# EAGLE design SpeccyPower5v (EAGLE 6.3)
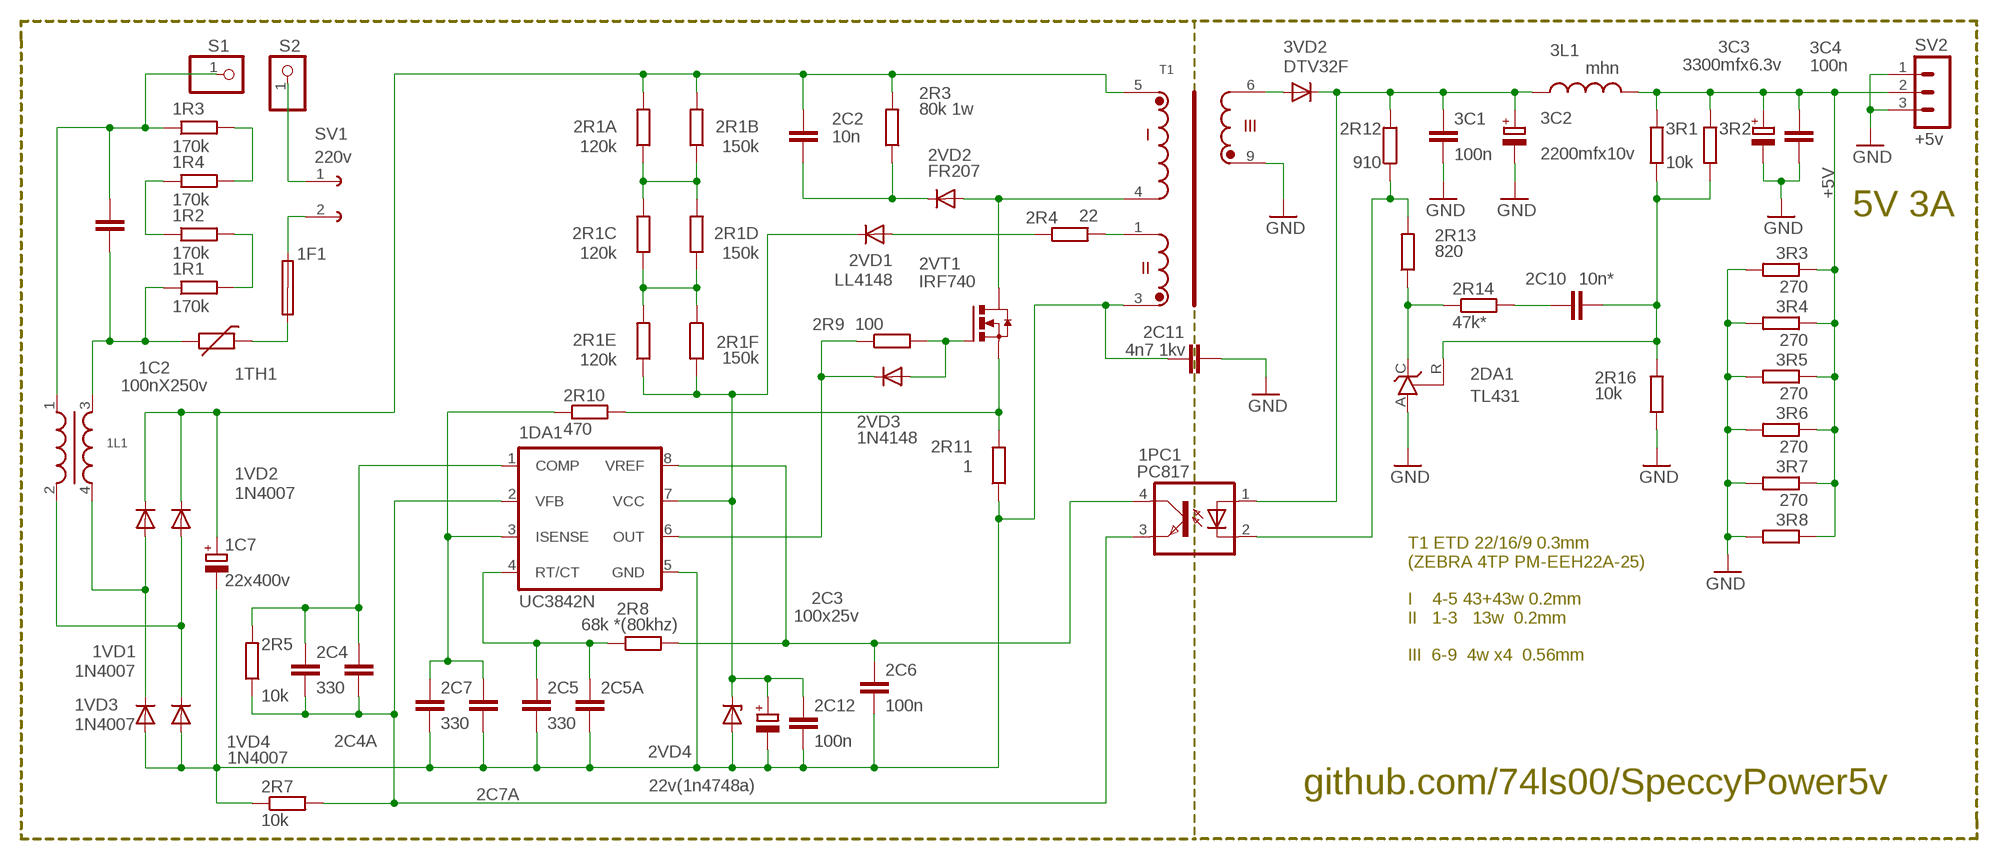
[diagram p0: schematic, sheet 1]

## Parts
1C2  100nX250v  C-EU150-064X183  [C150-064X183]
1C7  22x400v  CPOL-EUTT5D11L  [TT5D11L]
1DA1  UC3842N  [DIL08]
1F1  SHK20L  [SHK20L]
1L1  LFLF-10X13  [LF-10X13]
1PC1  PC817  [DIL04]
1R1  170k  R-EU_R0805  [R0805]
1R2  170k  R-EU_R0805  [R0805]
1R3  170k  R-EU_R0805  [R0805]
1R4  170k  R-EU_R0805  [R0805]
1TH1  THERMISTOR-7,5  [R-7,5]
1VD1  1N4007  1N4004  [DO41-10]
1VD2  1N4007  1N4004  [DO41-10]
1VD3  1N4007  1N4004  [DO41-10]
1VD4  1N4007  1N4004  [DO41-10]
2C2  10n  C-EU102-043X133  [C102-043X133]
2C3  100x25v  CPOL-EUE2.5-6  [E2,5-6]
2C4  330  C-EU050-025X075  [C050-025X075]
2C4A  C-EUC0805  [C0805]
2C5  330  C-EU050-025X075  [C050-025X075]
2C5A  C-EUC0805  [C0805]
2C6  100n  C-EUC0805  [C0805]
2C7  330  C-EU050-025X075  [C050-025X075]
2C7A  C-EUC0805  [C0805]
2C10  10n*  C-EU050-025X075  [C050-025X075]
2C11  4n7 1kv  C-EU075-032X103  [C075-032X103]
2C12  100n  C-EUC0805  [C0805]
2DA1  TL431  TL431CLP  [TO92-CLP]
2R1A  120k  R-EU_M0805  [M0805]
2R1B  150k  R-EU_M0805  [M0805]
2R1C  120k  R-EU_M0805  [M0805]
2R1D  150k  R-EU_M0805  [M0805]
2R1E  120k  R-EU_M0805  [M0805]
2R1F  150k  R-EU_M0805  [M0805]
2R3  80k 1w  R-EU_0613/15  [P0613/15]
2R4  22  R-EU_M0805  [M0805]
2R5  10k  R-EU_0207/10  [0207/10]
2R7  10k  R-EU_0207/10  [0207/10]
2R8  68k *(80khz)  R-EU_R0805  [R0805]
2R9  100  R-EU_0204/7  [0204/7]
2R10  470  R-EU_0207/10  [0207/10]
2R11  1  R-EU_0411/15  [0411/15]
2R12  910  R-EU_R0805  [R0805]
2R13  820  R-EU_0204/7  [0204/7]
2R14  47k*  R-EU_R0805  [R0805]
2R16  10k  R-EU_R0805  [R0805]
2VD1  LL4148  DIODE-SOD80C  [SOD80C]
2VD2  FR207  1N4148DO35-10  [DO35-10]
2VD3  1N4148  1N4148DO35-7  [DO35-7]
2VD4  22v(1n4748a)  ZENER-DIODEDO35Z10  [DO35Z10]
2VT1  IRF740  IRF3704L-V  [TO262-V]
3C1  100n  C-EUC0805  [C0805]
3C2  2200mfx10v  CPOL-EUTT2D7L  [TT2D7L]
3C3  3300mfx6.3v  CPOL-EUTT2D7L-2  [TT2D7L-2]
3C4  100n  C-EUC0805  [C0805]
3L1  mhn  L-USLAL02  [LAL02]
3R1  10k  R-EU_R0805  [R0805]
3R2  R-EU_R0805  [R0805]
3R3  270  R-EU_R0805  [R0805]
3R4  270  R-EU_R0805  [R0805]
3R5  270  R-EU_R0805  [R0805]
3R6  270  R-EU_R0805  [R0805]
3R7  270  R-EU_R0805  [R0805]
3R8  R-EU_R0805  [R0805]
3VD2  DTV32F  DIODE-DO220S  [DO220S]
S1  PINHD-1X1  [1X01]
S2  PINHD-1X1  [1X01]
SV1  220v  IEC320-C8  [IEC320-C8]
SV2  +5v  MA03-1  [MA03-1]
T1  TRANS_ER29  [ER29]

## Nets
817-3: 1DA1.2(VFB) 1PC1.3(EMIT) 2C4.2 2C4A.2 2R5.1 2R7.2
+5V: 3C3.+ 3C4.1 3L1.2 3R1.2 3R2.2 3R3.1 3R4.1 3R5.1 3R6.1 3R7.1 3R8.1 SV2.2
+16IN: 1DA1.7(VCC) 2C3.+ 2C12.1 2R1E.1 2R1F.2 2VD1.C 2VD4.C
+IN: 1C7.+ 1VD1.C 1VD2.C 2C2.1 2R1A.2 2R1B.2 2R3.2 T1.5(IN2)
-IN: 1C7.- 1DA1.5(GND) 1VD3.A 1VD4.A 2C3.- 2C5.2 2C5A.2 2C6.2 2C7.2 2C7A.2 2C11.1 2C12.2 2R7.1 2R11.1 2VD4.A T1.3(OP2)
COMP: 1DA1.1(COMP) 2C4.1 2C4A.1 2R5.2
GND: 2C11.2 2DA1.A 2R16.1 3C1.2 3C2.- 3C3.- 3C4.2 3R3.2 3R4.2 3R5.2 3R6.2 3R7.2 3R8.2 SV2.1 SV2.3 T1.9(5V2)
N$1: 1L1.4 1VD1.A 1VD3.C
N$2: 1C2.1 1L1.3 1R1.1 1TH1.2
N$3: 1DA1.4(RT/CT) 2C5.1 2C5A.1 2R8.1
N$4: 1DA1.3(ISENSE) 2C7.1 2C7A.1 2R10.1
N$6: 2R4.1 2VD1.A
N$8: 1DA1.6(OUT) 2R9.1 2VD3.C
N$11: 2R9.2 2VD3.A 2VT1.1(G)
N$12: 1PC1.2(C) 2R12.1 2R13.2
N$13: 1PC1.1(A) 2R12.2 3C1.1 3C2.+ 3L1.1 3VD2.C
N$14: 2DA1.C 2R13.1 2R14.1
N$15: 1F1.1A SV1.2
N$16: 2C10.2 2R14.2
N$17: 2VD2.A 2VT1.2(D) T1.4(IN1)
N$18: 1R3.2 1R4.2
N$19: 2R1C.1 2R1D.1 2R1E.2 2R1F.1
N$20: 1DA1.8(VREF) 1PC1.4(COL) 2C6.1 2R8.2
N$21: 2R10.2 2R11.2 2VT1.3(S)
N$22: 2R4.2 T1.1(OP1)
N$25: 1R2.1 1R4.1
N$26: 2C10.1 2DA1.R 2R16.2 3R1.1 3R2.1
N$28: 3VD2.A T1.6(5V1)
N$29: 2R1A.1 2R1B.1 2R1C.2 2R1D.2
N$30: 2C2.2 2R3.1 2VD2.C
N$32: 1C2.2 1L1.1 1R3.1 S1.1
N$36: S2.1 SV1.1
N$44: 1L1.2 1VD2.A 1VD4.C
N$45: 1F1.2A 1TH1.1
N$46: 1R1.2 1R2.2
Unconnected: 1F1.1B 1F1.2B

## Notes on the sheet
- 5V 3A
- T1 ETD 22/16/9 0.3mm
  (ZEBRA 4TP PM-EEH22A-25)
  
  I    4-5 43+43w 0.2mm
  II   1-3   13w  0.2mm
  
  III  6-9  4w x4  0.56mm
- github.com/74ls00/SpeccyPower5v

## Library data of the parts
1C2 = SpeccyPower5v:C-EU: CAPACITOR, European symbol
1C7 3C2 3C3 = SpeccyPower5v:CPOL-EU: POLARIZED CAPACITOR, European symbol
1DA1 = SpeccyPower5v:UC384*: SMPS Controller Source: http://www.fairchildsemi.com/ds/UC/UC3843.pdf
1F1 = fuse:SHK20L: FUSE HOLDER 5 x 20 mm, SH contact, SHH1 Schukat, E1073 Buerklin; OC_FARNELL: unknown; OC_NEWARK: unknown
1L1 = SpeccyPower5v:LF
1PC1 = optocoupler:PC817: SHARP OPTO COUPLER; MPN: PC817X4J000F; OC_FARNELL: 9707727; OC_NEWARK: 97K7059
1R1-1R4 2R1A 2R1B 2R1C 2R1D 2R1E 2R1F 2R3-2R5 2R7-2R14 2R16 3R1-3R8 = rcl:R-EU_: RESISTOR, European symbol
1TH1 = varistor:THERMISTOR: THERMISTOR
1VD1-1VD4 = diode:1N4004: DIODE general purpose rectifier, 1 A
2C2 2C4 2C4A 2C5 2C5A 2C6 2C7 2C7A 2C10-2C12 3C1 3C4 = rcl:C-EU: CAPACITOR, European symbol
2C3 = rcl:CPOL-EU: POLARIZED CAPACITOR, European symbol
2DA1 = v-reg:TL431CLP: VOLTAGE REGULATOR
2VD1 3VD2 = diode:DIODE-: DIODE
2VD2 2VD3 = SpeccyPower5v:1N4148: DIODE high speed (Philips)
2VD4 = SpeccyPower5v:ZENER-DIODE: Z-Diode
2VT1 = transistor-power:IRF3704: SMPS MOSFET HEXFET® Power MOSFET Source: http://www.irf.com/product-info/datasheets/data/irf3704.pdf
3L1 = rcl:L-US: INDUCTOR, American symbol
S1 S2 = pinhead:PINHD-1X1: PIN HEADER
SV1 = SpeccyPower5v:IEC320-C8: FEMALE HEADER; OC_FARNELL: unknown; OC_NEWARK: unknown
SV2 = con-lstb:MA03-1: PIN HEADER; OC_FARNELL: unknown; OC_NEWARK: unknown
T1 = SpeccyPower5v:TRANS_ER29

## Board
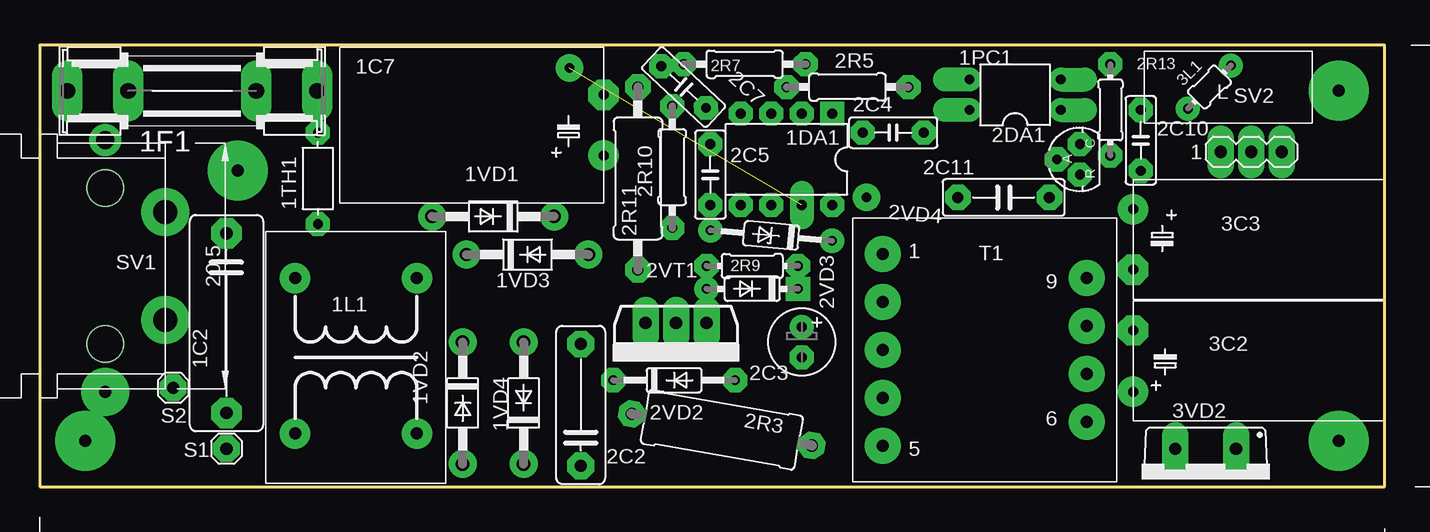
[diagram p1: board, top side]
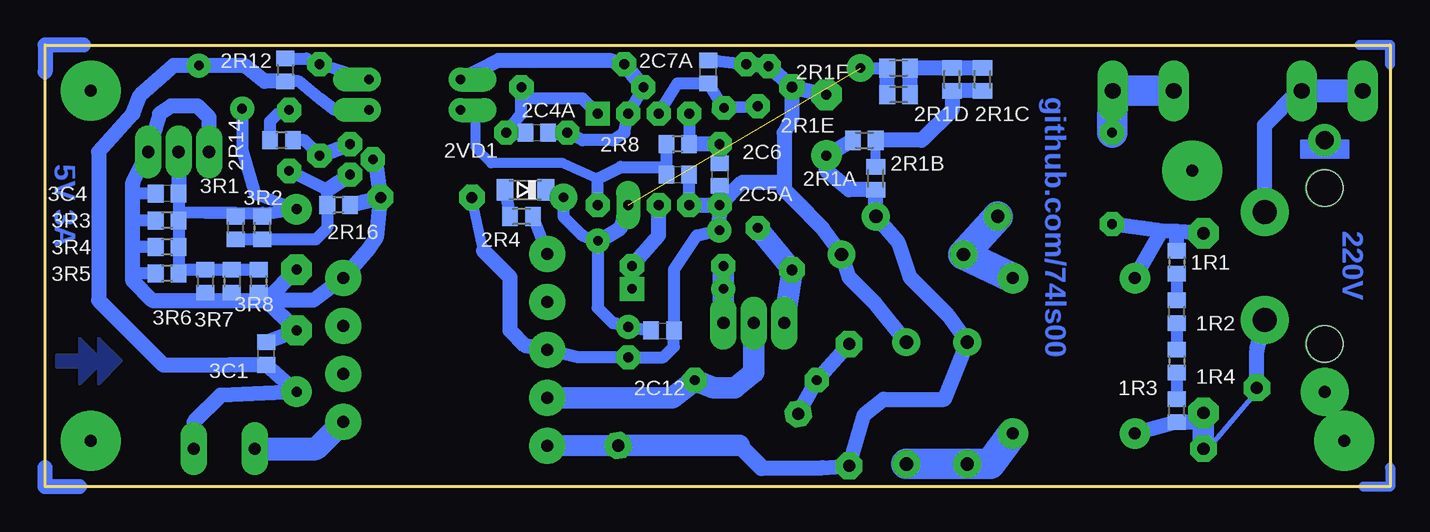
[diagram p2: board, bottom side, seen from below]

Size 112.08 x 36.83 mm. Coordinates in mm from the lower left corner, seen from the top.
Outline: 0,36.83 0,0 112.08,0 112.08,36.83 0,36.83
Copper layers (1*16): Top 0.035mm / dielectric 1.5mm / Bottom 0.035mm
Design rules "DesignRules": minimum track width 8mil, minimum drill 24mil, track to track 0.2mm, track to pad 0.2mm, pad to pad 8mil, via to via 8mil, smd to smd 8mil, copper to edge 10mil, drill to drill 8mil, minimum pad ring 0.6mm, minimum via ring 8mil, stop-mask expansion 4mil, vias tented up to drill 0mil, thermal gap 10mil

### Footprints (pad centres in the part's own frame; a part is rotated, then mirrored left to right if it is on the bottom)
C150-064X183 = drill 1.016 pad 2.54 octagon: 1 -7.493,0; 2 7.493,0
TT5D11L = drill 0.813 pad 2.54: + -2.54,0 | drill 0.813 pad 2.54 octagon: - 2.54,0
DIL08 = drill 0.813 square: 1 -3.81,-3.81 | drill 0.813 octagon: 2 -1.27,-3.81; 3 1.27,-3.81; 4 3.81,-3.81; 5 3.81,3.81; 6 1.27,3.81; 8 -3.81,3.81 | drill 0.813 long: 7 -1.27,3.81
SHK20L = drill 1.321 pad 2.54 long: 1A -10.414,0; 1B -5.334,0; 2A 10.414,0; 2B 5.334,0
LF-10X13 = drill 1 pad 2.54: 1 -6.35,5.08; 2 -6.35,-5.08; 3 6.604,5.08; 4 6.604,-5.08
DIL04 = drill 0.813 offset: 1 -1.27,-3.81; 2 1.27,-3.81; 3 1.27,3.81; 4 -1.27,3.81
R0805 = smd 1.3 x 1.5: 1 -0.95,0; 2 0.95,0
R-7,5 = drill 0.813 octagon: 1 -3.81,0; 2 3.81,0
DO41-10 = drill 1.118: A 5.08,0; C -5.08,0
C102-043X133 = drill 1.016 octagon: 1 -5.08,0; 2 5.08,0
E2,5-6 = drill 0.813 pad 1.6: + -1.27,0 | drill 0.813 pad 1.6 octagon: - 1.27,0
C050-025X075 = drill 0.813 octagon: 1 -2.54,0; 2 2.54,0
C0805 = smd 1.3 x 1.5: 1 -0.95,0; 2 0.95,0
C075-032X103 = drill 0.914 octagon: 1 -3.81,0; 2 3.81,0
TO92-CLP = drill 0.813 octagon: A 0,1.905; C 1.27,0; R -1.27,0
M0805 = smd 1.3 x 1.6: 1 -0.95,0; 2 0.95,0
P0613/15 = drill 1.016 octagon: 1 -7.62,0; 2 7.62,0
0207/10 = drill 0.813 octagon: 1 -5.08,0; 2 5.08,0
0204/7 = drill 0.813 octagon: 1 -3.81,0; 2 3.81,0
0411/15 = drill 0.914 octagon: 1 -7.62,0; 2 7.62,0
SOD80C = smd 1.4 x 1.8: A 1.7,0; C -1.7,0
DO35-10 = drill 0.813 octagon: A 5.08,0; C -5.08,0
DO35-7 = drill 0.813: A 3.81,0 | drill 0.813 square: C -3.81,0
DO35Z10 = drill 0.813: A 5.08,0; C -5.08,0
TO262-V = drill 1.016 long: 1 -2.54,0; 2 0,0; 3 2.54,0
TT2D7L = drill 0.813 pad 2.54: + 2.56,0 | drill 0.813 pad 2.54 octagon: - -2.56,0
TT2D7L-2 = drill 0.813 pad 2.54: + -2.52,0 | drill 0.813 pad 2.54 octagon: - 2.52,0
LAL02 = drill 0.8 pad 1.3: 1 -2.54,0; 2 2.54,0
DO220S = drill 1.016 long: A 2.54,-2.54; C -2.54,-2.54
1X01 = drill 1.016 octagon: 1 0,0
IEC320-C8 = drill 2 pad 4: 1 -4.5,-13; 2 4.5,-13 | drill 2 pad 3: P$3 -6.5,-8; P$4 6.5,-8 | drill 1 pad 4: P$5 -10.5,-8 | drill 1.5 pad 2.54: P$6 10.5,-8 | hole 3: -6.5,-8; 6.5,-8
MA03-1 = drill 1.016 long: 1 -2.54,0; 2 0,0; 3 2.54,0
ER29 = drill 1 pad 3: 1 -8.5,8; 2 -8.5,4; 3 -8.5,0; 4 -8.5,-4; 5 -8.5,-8; 6 8.5,-6; 7 8.5,-2; 8 8.5,2; 9 8.5,6

### Placement (x,y rotation side)
1C2  15.56,13.65 270 top
1C7  46.99,30.16 90 top
1DA1  62.23,27.3 180 top
1F1  12.7,33.02 0 top
1L1  26.35,10.8 90 top
1PC1  81.28,32.7 90 top
1R1  17.78,18.73 270 bottom
1R2  17.78,14.61 90 bottom
1R3  17.78,6.35 90 bottom
1R4  17.78,10.48 270 bottom
1TH1  23.18,25.72 270 top
1VD1  37.78,22.54 180 top
1VD2  35.24,6.98 270 top
1VD3  40.64,19.37 0 top
1VD4  40.32,6.98 90 top
2C2  45.08,6.83 90 top
2C3  63.5,12.07 270 top
2C4  71.12,29.53 180 top
2C4A  71.12,29.53 0 bottom
2C5  55.88,26.04 270 top
2C5A  55.88,26.04 270 bottom
2C6  59.37,26.04 0 bottom
2C7  53.66,33.34 137 top
2C7A  56.83,34.61 90 bottom
2C10  91.76,28.89 90 top
2C11  80.33,24.13 0 top
2C12  60.64,13.02 0 bottom
2DA1  86.68,27.3 90 top
2R1A  43.81,28.89 180 bottom
2R1B  42.86,25.72 270 bottom
2R1C  33.97,33.97 270 bottom
2R1D  36.51,33.97 270 bottom
2R1E  40.96,32.7 0 bottom
2R1F  40.96,34.93 180 bottom
2R3  56.83,4.76 350 top
2R4  72.39,22.54 0 bottom
2R5  67.31,33.34 0 top
2R7  58.74,35.24 0 top
2R8  59.37,28.58 180 bottom
2R9  59.37,18.41 180 top
2R10  52.7,26.67 270 top
2R11  49.85,25.72 270 top
2R12  92.08,34.77 270 bottom
2R13  89.22,31.43 90 top
2R14  92.39,28.89 180 bottom
2R16  87.63,23.49 180 bottom
2VD1  72.07,24.77 180 bottom
2VD2  52.86,8.89 0 top
2VD3  59.37,16.51 180 top
2VD4  60.96,20.96 175 top
2VT1  53.02,13.65 180 top
3C1  93.66,11.11 90 bottom
3C2  91.12,10.48 270 top
3C3  91.12,20.64 270 top
3C4  101.92,24.45 180 bottom
3L1  97.47,33.34 225 top
3R1  96.2,21.59 90 bottom
3R2  93.98,21.59 90 bottom
3R3  101.92,22.23 180 bottom
3R4  101.92,20 180 bottom
3R5  101.92,17.78 180 bottom
3R6  98.74,17.14 270 bottom
3R7  96.52,17.14 270 bottom
3R8  94.3,17.14 270 bottom
3VD2  97.16,0.64 180 top
S1  15.56,3.18 0 top
S2  11.11,8.26 0 top
SV1  -2.54,18.41 90 top
SV2  100.96,27.94 0 top
T1  78.74,11.43 0 top
U$1  [_L]  99.06,33.34 0 top

### Tracks (layer width: path | path; a pad name or v marks a point on that pad's centre or on a via)
817-3
  Bottom 1.016: 2R5.1 1DA1.2 63.82,29.53 64.77,28.89 67.31,28.89 2C4.2
  Bottom 1.27: 2R5.1 2R7.2 65.09,35.56 74.3,35.56 1PC1.3 | 2C4A.2 2C4.2
+5V
  Bottom 1.016: 3L1.2 95.68,28.05 94.61,24.45 3C3.+ 93.35,22.84 93.98,22.84 | 3R1.2 96.2,22.84 | 96.2,22.84 93.98,22.84 | 96.2,22.84 98.74,22.84 100.97,22.86 | 3C4.1 100.97,22.86 | 100.97,22.86 3R3.1 3R4.1 3R5.1 100.65,18.1 3R6.1 3R7.1 3R8.1 | 93.98,22.84 3R2.2
  Bottom 1.27: SV2.2 100.96,24.76 100.97,24.76 3C4.1
+16IN  (via drill 0.8 pad 2.3)  (1 unrouted)
  Bottom 1.016: v44.13,34.93 2R1F.2 | 2C12.1 2C3.+ 64.77,13.65 66.04,14.92 2VD4.C 67.31,20.96 68.9,22.54 v68.9,24.13 2VD1.C
  Bottom 1.27: 2VD4.C 65.72,20.64 64.13,21.59 1DA1.7 | 2R1E.1 2R1F.2
+IN
  Bottom 1.27: 52.39,1.59 47.31,1.59 2C2.1 43.82,6.03 42.23,7.3 37.15,7.3 1VD2.C 36.83,14.29 40,17.46 40.96,20.32 1VD1.C 2R1B.2 45.09,24.77 46.99,26.35 1C7.+ 2R1A.2
  Bottom 1.422: 54.26,3.46 52.39,1.59
  Bottom 1.778: T1.5 2R3.2 54.26,3.46
-IN
  Bottom 0.813: 75.57,19.69 2C11.1
  Bottom 1.016: 1DA1.5 2C6.2 | 2C7A.2 56.19,35.56 2R7.1 | T1.3 67.7,10.8 2C3.- 60.57,10.8 59.69,11.67 2C12.2 59.69,18.1 57.79,20.96 2VD4.A
  Bottom 1.27: 2R7.1 2C7.2 2R11.1 | 2R11.1 1C7.- | 1DA1.5 2C5.2 | 2VD4.A 2C5.2 | 50.49,25.4 50.49,29.52 49.85,30.8 2R11.1 | 50.49,25.4 50.49,24.78 49.54,23.83 47.31,21.59 46.04,19.83 1VD3.A 45.08,17.46 42.86,15.24 1VD4.A | 2C5.2 53.97,25.4 50.49,25.4 | 2C5A.2 2C5.2 | T1.3 72.07,11.75 73.34,13.02 73.34,17.46 75.57,19.69
COMP
  Bottom 1.016: 2C4.1 72.39,31.12 72.39,32.38 | 72.39,32.38 2R5.2 | 1DA1.1 67.31,32.38 72.39,32.38
  Bottom 1.27: 2C4A.1 2C4.1
GND
  Bottom 1.016: 3R5.2 104.46,17.78 104.77,18.1 | 3R4.2 104.77,20 | 3R3.2 104.46,22.23 104.77,22.54 | 3C4.2 104.77,24.45
  Bottom 1.27: 2R16.1 2C11.2 | 2C11.2 84.46,20.85 85.09,19.89 T1.9 89.75,15.56 93.66,15.56 | 2C11.2 84.46,26.67 84.46,26.99 2DA1.A | SV2.1 98.43,30.8 99.38,31.75 101.6,31.75 102.55,31.12 SV2.3 104.77,25.4 104.77,24.45 104.77,22.54 104.77,20 104.77,18.1 104.77,17.14 103.19,15.56 98.43,15.56 | 3C3.- 93.66,15.56 | 93.66,15.56 3C2.- 3C1.2 | 98.43,15.56 96.2,15.56 | 96.2,15.56 94.46,15.56 | 94.46,15.56 93.66,15.56 | 3R6.2 98.43,15.56 | 3R7.2 96.2,15.56 | 3R8.2 94.3,15.72 94.46,15.56
N$1
  Bottom 2.54: 1VD1.A 1VD3.C 1L1.4
N$2
  Bottom 1.27: 1C2.1 17.78,21.3 | 17.78,21.3 19.05,21.32 | 19.05,21.32 1TH1.2 | 1R1.1 17.78,21.3 | 1L1.3 19.05,21.32
N$3
  Bottom 1.016: 1DA1.4 2R8.1
  Bottom 1.27: 2R8.1 2C5.1 2C5A.1
N$4
  Bottom 1.016: 2R10.1 2C7.1 2C7A.1 59.37,33.66 1DA1.3
N$5  (via drill 1 pad 5)
  other vias: 3.81,3.81
N$6
  Bottom 1.016: 2VD1.A 2R4.1
N$7  (via drill 1 pad 5)
  other vias: 16.51,26.35
N$8
  Bottom 1.27: 2VD3.C 2R9.1 60.96,20.96 1DA1.6
N$9  (via drill 1 pad 5)
  other vias: 108.27,3.81
N$10  (via drill 1 pad 5)
  other vias: 108.27,33.02
N$11
  Bottom 1.778: 2VT1.1 2VD3.A 2R9.2
N$12
  Bottom 1.016: 2R12.1 90.33,35.72 2R13.2 1PC1.2
N$13
  Bottom 1.016: 1PC1.1 87.95,31.43 89.22,32.38 90.96,33.81 2R12.2
  Bottom 1.27: 3VD2.C 99.69,5.4 97.45,7.64 3C2.+ 3C1.1 96.2,10.16 96.83,10.16 102.24,10.16 107.63,15.56 107.63,27.94 104.77,31.12 104.14,32.7 101.39,35.13 3L1.1 95.46,35.13 93.82,33.82 2R12.2
N$14
  Bottom 1.016: 2R13.1 90.49,28.89 2R14.1
  Bottom 1.27: 2R13.1 2DA1.C
N$15
  Bottom 1.27: SV1.2 10.46,30.18 7.62,33.02
  Bottom 1.93: 7.62,33.02 1F1.1A
N$16
  Bottom 1.016: 2R14.2 93.34,30.48 92.71,31.12 2C10.2
N$17
  Bottom 1.778: T1.4 59.82,7.43 2VD2.A 56.36,8.26 54.61,8.26 53.02,9.53 2VT1.2
N$18
  Bottom 1.016: 1R4.2 1R3.2
N$19
  Bottom 1.27: 2R1E.2 2R1F.1 38.1,34.92 2R1D.1 2R1C.1
N$20
  Bottom 0.813: 76.2,31.43 76.2,28.26 74.93,26.99 68.9,26.99 66.04,25.72
  Bottom 1.016: 2R8.2 60.32,26.35 | 60.32,26.35 2C6.1 | 1DA1.8 66.04,25.72 64.13,26.67 60.64,26.67 60.32,26.35 | 76.2,31.43 1PC1.4
N$21
  Bottom 1.778: 2R10.2 2R11.2 2VT1.3
N$22
  Bottom 1.016: 2R4.2 T1.1
N$23
  pour Bottom: 107.63,12.38 107.63,10.8 109.22,12.38 109.22,10.95 111.12,10.95 111.12,10 109.22,10 109.22,8.57 107.63,10.16 107.63,8.57 105.73,10.48
N$25
  Bottom 1.016: 1R2.1 1R4.1
N$26
  Bottom 1.016: 2C10.1 88.58,24.77 2R16.2 88.58,21.59 89.54,20.64 3R2.1 3R1.1
  Bottom 1.27: 88.58,24.77 2DA1.R
N$27
  Bottom 0.813: 0,35.24 0,36.83 2.54,36.83
N$28
  Bottom 1.93: 3VD2.A 89.49,3.17 T1.6
N$29
  Bottom 0.813: 2R1B.1 2R1A.1
  Bottom 1.27: 2R1C.2 2R1D.2 36.51,31.43 39.05,28.89 2R1A.1
N$30
  Bottom 1.27: 2R3.1 2VD2.C 2C2.2
N$31
  Bottom 0.813: 0,1.59 0,0 2.22,0
N$32
  Bottom 1.27: 1C2.2 16.63,5.4 1R3.1 1L1.1
  Bottom 1.778: 1C2.2 S1.1
N$33
  Bottom 1.27: 109.22,0 112.08,0 112.08,1.59
N$34
  Bottom 1.27: 108.9,36.83 112.08,36.83 112.08,34.61
N$36
  Bottom 1.27: S2.1 11.11,11.36 SV1.1
N$37
  Bottom 0.406: 11.43,7.62 14.92,3.49
N$44
  Bottom 2.54: 1VD4.C 1VD2.A 33.34,1.91 1L1.2
N$45
  Bottom 2.54: 18.1,33.02 1F1.2A 1TH1.1
N$46
  Bottom 1.016: 1R1.2 1R2.2

### Text on the board
Bottom: 5V 3A | 220V | github.com/74ls00